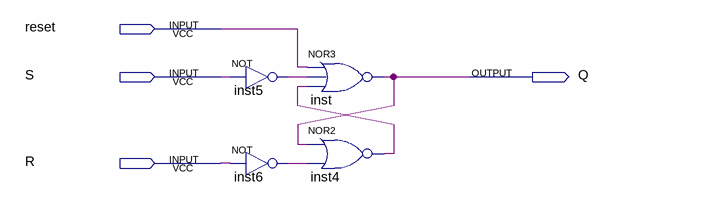
[diagram p0: schematic sheet]
// Quartus schematic latch_SR_reset.bdf as structural Verilog: 4 symbols, 4 pins
module latch_SR_reset (
  input  reset,
  input  S,
  input  R,
  output Q
);

  wire inst4_out, inst5_out, inst6_out;

  not inst5 (inst5_out, S);
  not inst6 (inst6_out, R);
  nor inst (Q, reset, inst5_out, inst4_out);
  nor inst4 (inst4_out, Q, inst6_out);
endmodule
